# EAGLE schematic Tiny_UniProg (EAGLE 9.5.1)
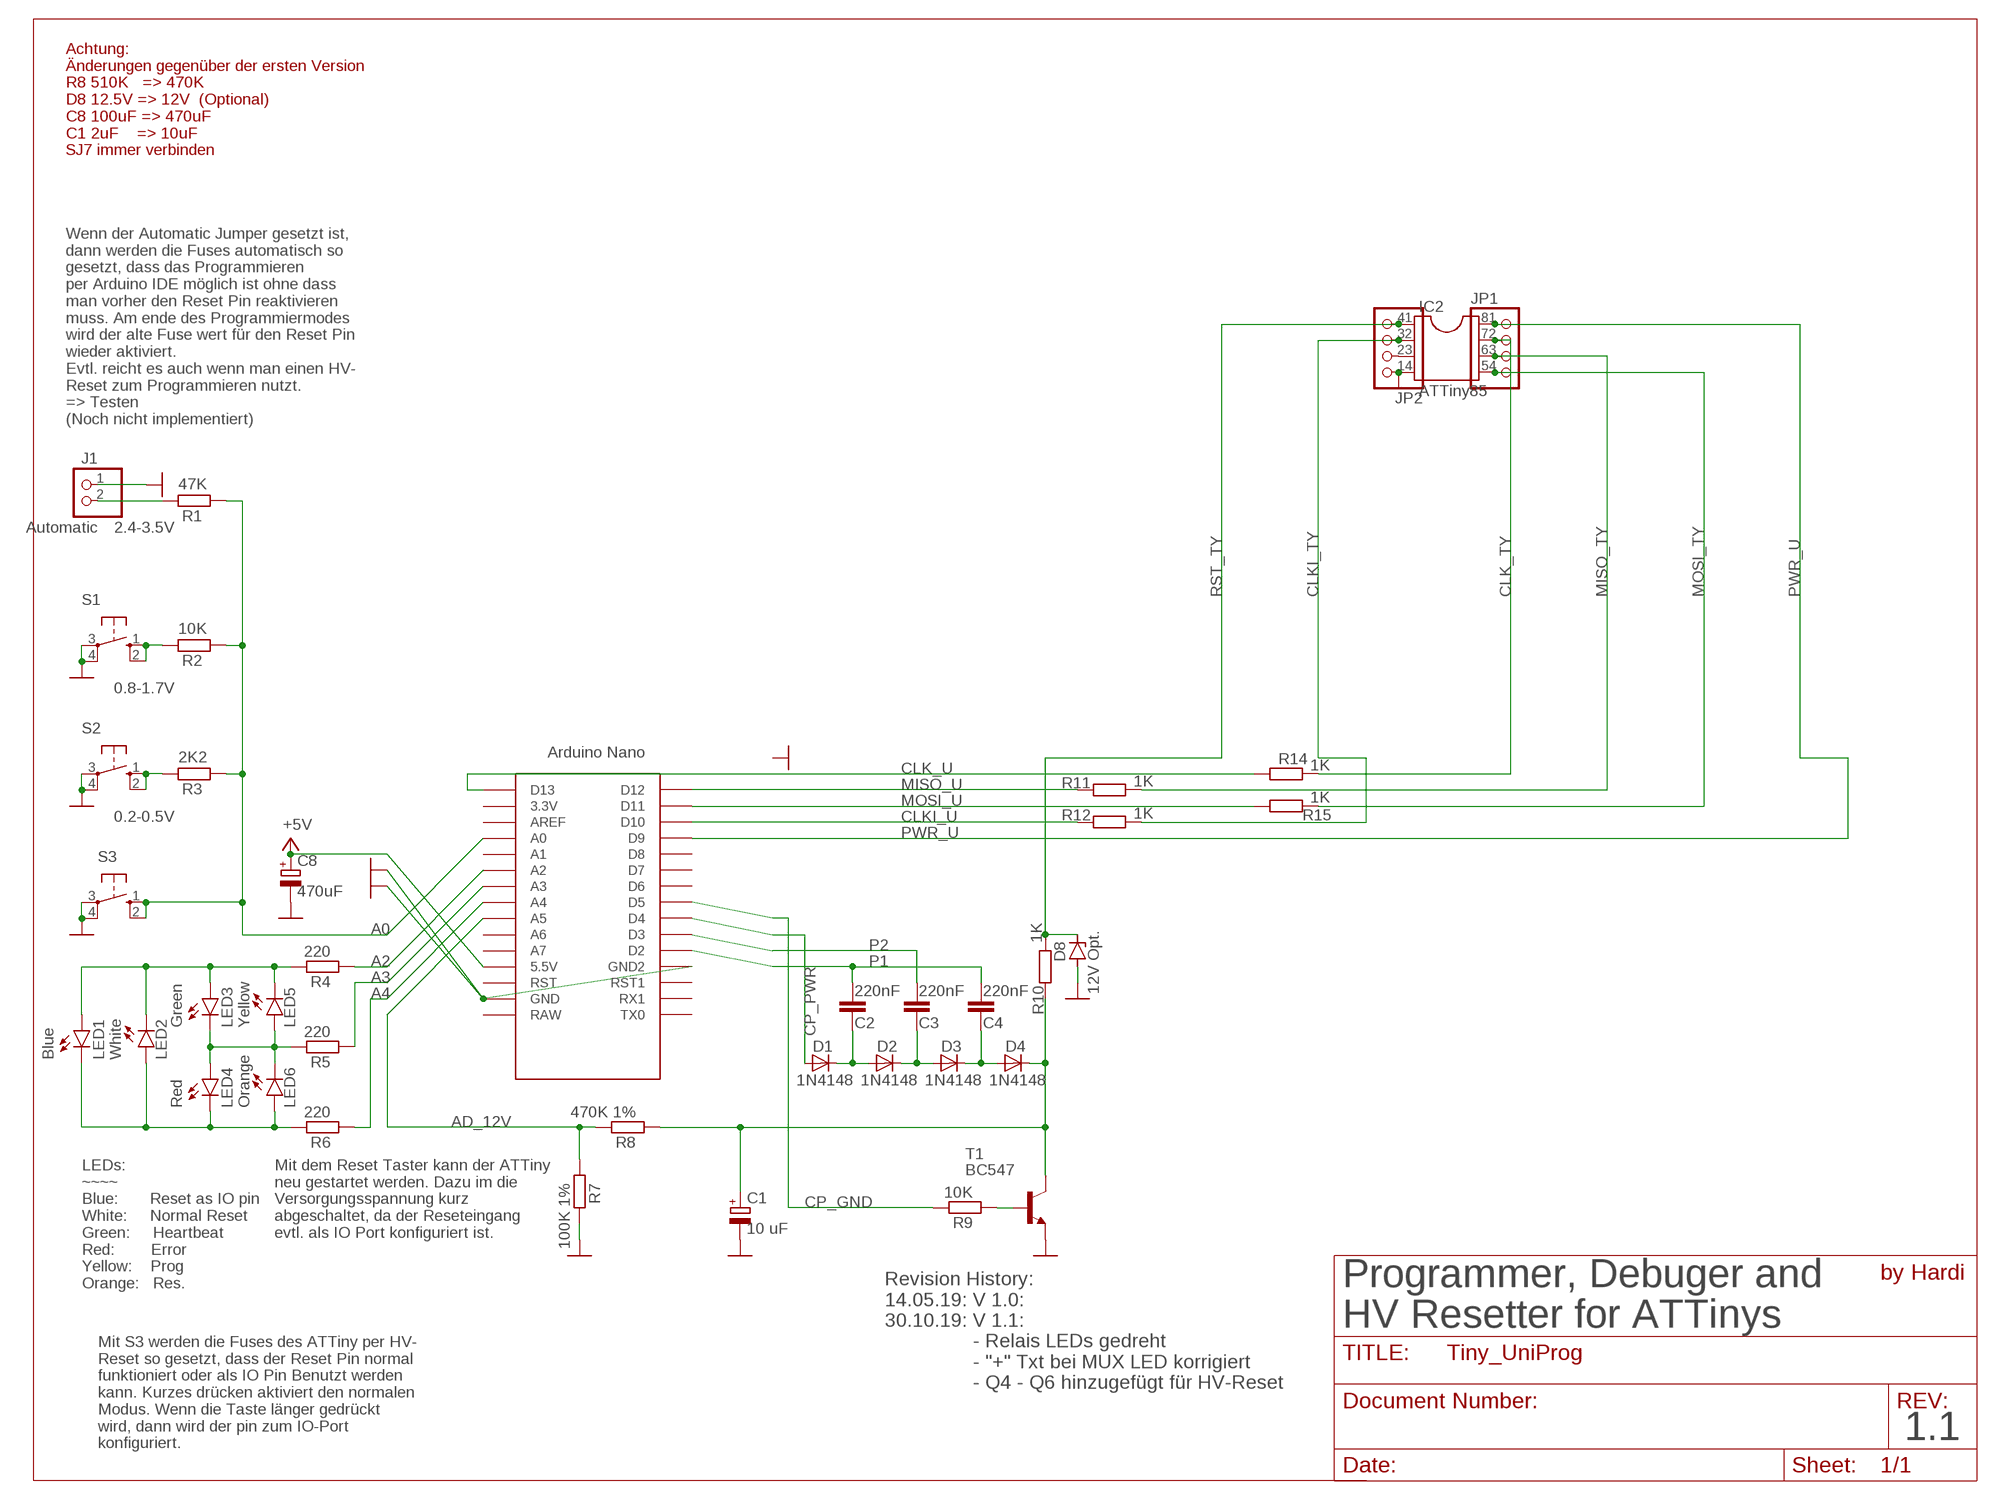
[diagram p0: schematic, sheet 1]

## Parts
C1  10 uF  CPOL-EUE5-5  [E5-5]
C2  220nF  C-EU050-024X044  [C050-024X044]
C3  220nF  C-EU050-024X044  [C050-024X044]
C4  220nF  C-EU050-024X044  [C050-024X044]
C8  470uF  CPOL-EUE5-10.5  [E5-10,5]
D1  1N4148  1N4148DO35-2  [DO35-2]
D2  1N4148  1N4148DO35-2  [DO35-2]
D3  1N4148  1N4148DO35-2  [DO35-2]
D4  1N4148  1N4148DO35-2  [DO35-2]
D8  12V Opt.  ZENER-DIODEZD-2.5  [ZDIO-2.5]
IC2  ATTiny85  DIL8  [DIL08]
J1  Automatic  PINHD-1X2  [1X02]
JP1  PINHD-1X4  [1X04]
JP2  PINHD-1X4  [1X04]
LED1  Blue  LED3MM  [LED3MM]
LED2  White  LED3MM  [LED3MM]
LED3  Green  LED3MM  [LED3MM]
LED4  Red  LED3MM  [LED3MM]
LED5  Yellow  LED3MM  [LED3MM]
LED6  Orange  LED3MM  [LED3MM]
R1  47K  R-EU_0204/2V  [0204V]
R2  10K  R-EU_0204/2V  [0204V]
R3  2K2  R-EU_0204/2V  [0204V]
R4  220  R-EU_0204/5  [0204/5]
R5  220  R-EU_0204/2V  [0204V]
R6  220  R-EU_0204/5  [0204/5]
R7  100K 1%  R-EU_0204/7  [0204/7]
R8  470K 1%  R-EU_0204/2V  [0204V]
R9  10K  R-EU_0207/12  [0207/12]
R10  1K  R-EU_0204/2V  [0204V]
R11  1K  R-EU_0204/2V  [0204V]
R12  1K  R-EU_0204/5  [0204/5]
R14  1K  R-EU_0207/12  [0207/12]
R15  1K  R-EU_0204/5  [0204/5]
S1  10-XX  [B3F-10XX]
S2  10-XX  [B3F-10XX]
S3  10-XX  [B3F-10XX]
T1  BC547  [TO92]
U$1  NANO  [NANO]

## Nets
+5V: C8.+ U$1.5V(5.5V)
A0: R1.1 R2.1 R3.1 S3.1(S) S3.2(S1) U$1.A0
A2: R4.1 U$1.A2
A3: R5.1 U$1.A3
A4: R6.1 U$1.A4
AD_12V: R7.1 R8.2 U$1.A5
CLK_TY: IC2.7 JP1.2 R14.2
CLK_U: R14.1 U$1.D13
CLKI_TY: IC2.2 JP2.3 R12.2
CLKI_U: R12.1 U$1.D10
CP_GND: R9.2 U$1.D5
CP_PWR: D1.A U$1.D4
GND: C1.- C8.- D8.A IC2.4 J1.1 JP2.1 R7.2 S1.3(P) S1.4(P1) S2.3(P) S2.4(P1) S3.3(P) S3.4(P1) T1.1(E) U$1.GND U$1.GND1(GND2)
MISO_TY: IC2.6 JP1.3 R11.2
MISO_U: R11.1 U$1.D12
MOSI_TY: IC2.5 JP1.4 R15.2
MOSI_U: R15.1 U$1.D11
N$1: C2.2 D1.C D2.A
N$2: C3.2 D2.C D3.A
N$3: C4.2 D3.C D4.A
N$4: IC2.3 JP2.2
N$7: R9.1 T1.2(B)
N$9: C1.+ D4.C R8.1 R10.2 T1.3(C)
N$28: J1.2 R1.2
N$33: R3.2 S2.1(S) S2.2(S1)
N$34: LED1.A LED2.K(C) LED3.A LED5.K(C) R4.2
N$42: LED3.K(C) LED4.A LED5.A LED6.K(C) R5.2
N$44: LED1.K(C) LED2.A LED4.K(C) LED6.A R6.2
N$67: R2.2 S1.1(S) S1.2(S1)
P1: C2.1 C4.1 U$1.D2
P2: C3.1 U$1.D3
PWR_U: IC2.8 JP1.1 U$1.D9
RST_TY: D8.C IC2.1 JP2.4 R10.1
Unconnected: U$1.3.3V U$1.A1 U$1.A6 U$1.A7 U$1.AREF U$1.D6 U$1.D7 U$1.D8 U$1.ICSP1 U$1.ICSP2 U$1.ICSP3 U$1.ICSP4 U$1.ICSP5 U$1.ICSP6 U$1.RAW U$1.RST U$1.RST1 U$1.RX1 U$1.TX0

## Notes on the sheet
- Achtung:
  Änderungen gegenüber der ersten Version
  R8 510K   => 470K
  D8 12.5V => 12V  (Optional)
  C8 100uF => 470uF
  C1 2uF    => 10uF
  SJ7 immer verbinden
- Wenn der Automatic Jumper gesetzt ist,
  dann werden die Fuses automatisch so
  gesetzt, dass das Programmieren
  per Arduino IDE möglich ist ohne dass
  man vorher den Reset Pin reaktivieren
  muss. Am ende des Programmiermodes
  wird der alte Fuse wert für den Reset Pin
  wieder aktiviert.
  Evtl. reicht es auch wenn man einen HV-
  Reset zum Programmieren nutzt.
  => Testen
  (Noch nicht implementiert)
- 2.4-3.5V
- 0.8-1.7V
- 0.2-0.5V
- LEDs:
  ~~~~
  Blue:       Reset as IO pin
  White:     Normal Reset
  Green:     Heartbeat
  Red:        Error
  Yellow:    Prog
  Orange:   Res.
- Mit dem Reset Taster kann der ATTiny
  neu gestartet werden. Dazu im die
  Versorgungsspannung kurz
  abgeschaltet, da der Reseteingang
  evtl. als IO Port konfiguriert ist.
- Revision History:
  14.05.19: V 1.0: 
  30.10.19: V 1.1: 
                  - Relais LEDs gedreht 
                  - "+" Txt bei MUX LED korrigiert
                  - Q4 - Q6 hinzugefügt für HV-Reset
- by Hardi
- Programmer, Debuger and 
  HV Resetter for ATTinys
- Mit S3 werden die Fuses des ATTiny per HV-
  Reset so gesetzt, dass der Reset Pin normal
  funktioniert oder als IO Pin Benutzt werden
  kann. Kurzes drücken aktiviert den normalen
  Modus. Wenn die Taste länger gedrückt
  wird, dann wird der pin zum IO-Port 
  konfiguriert.
- 1.1

## Library data of the parts
C1 C8 = rcl:CPOL-EU: POLARIZED CAPACITOR, European symbol; SPICEPREFIX: C
C2-C4 = rcl:C-EU: CAPACITOR, European symbol; SPICEPREFIX: C
D1-D4 = diode:1N4148: DIODE high speed (Philips)
D8 = diode:ZENER-DIODE: Z-Diode
IC2 = ic-package:DIL8: Dual In Line / Socket
J1 = pinhead:PINHD-1X2: PIN HEADER
JP1 JP2 = pinhead:PINHD-1X4: PIN HEADER
LED1-LED6 = led:LED: LED OSRAM: - CHIPLED LG R971, LG N971, LY N971, LG Q971, LY Q971, LO R971, LY R971 LH N974, LH R974 LS Q976, LO Q976, LY Q976 LO Q996 - Hyper CHIPLED LW Q18S LB Q993, LB Q99A, LB R99A - SideLED LS A670, LO A670, LY A670, LG A670, LP A670 LB A673, LV A673, LT A673, LW A673 LH A674 LY A675 LS A676, LA A676, LO A676, LY A676, LW A676 LS A679, LY A679, LG A679 - Hyper Micro SIDELED® LS Y876, LA Y876, LO Y876, LY Y876 LT Y87S - SmartLED LW L88C, LW L88S LB L89C, LB L89S, LG L890 LS L89K, LO L89K, LY L89K LS L896, LA L896, LO L896, LY L896 - TOPLED LS T670, LO T670, LY T670, LG T670, LP T670 LSG T670, LSP T670, LSY T670, LOP T670, LYG T670 LG T671, LOG T671, LSG T671 LB T673, LV T673, LT T673, LW T673 LH T674 LS T676, LA T676, LO T676, LY T676, LB T676, LH T676, LSB T676, LW T676 LB T67C, LV T67C, LT T67C, LS T67K, LO T67K, LY T67K, LW E67C LS E67B, LA E67B, LO E67B, LY E67B, LB E67C, LV E67C, LT E67C LW T67C LS T679, LY T679, LG T679 LS T770, LO T770, LY T770, LG T770, LP T770 LB T773, LV T773, LT T773, LW T773 LH T774 LS E675, LA E675, LY E675, LS T675 LS T776, LA T776, LO T776, LY T776, LB T776 LHGB T686 LT T68C, LB T68C - Hyper Mini TOPLED® LB M676 - Mini TOPLED Santana® LG M470 LS M47K, LO M47K, LY M47K Source: http://www.osram.convergy.de LUXEON: - LUMILED® LXK2-PW12-R00, LXK2-PW12-S00, LXK2-PW14-U00, LXK2-PW14-V00 LXK2-PM12-R00, LXK2-PM12-S00, LXK2-PM14-U00 LXK2-PE12-Q00, LXK2-PE12-R00, LXK2-PE12-S00, LXK2-PE14-T00, LXK2-PE14-U00 LXK2-PB12-K00, LXK2-PB12-L00, LXK2-PB12-M00, LXK2-PB14-N00, LXK2-PB14-P00, LXK2-PB14-Q00 LXK2-PR12-L00, LXK2-PR12-M00, LXK2-PR14-Q00, LXK2-PR14-R00 LXK2-PD12-Q00, LXK2-PD12-R00, LXK2-PD12-S00 LXK2-PH12-R00, LXK2-PH12-S00 LXK2-PL12-P00, LXK2-PL12-Q00, LXK2-PL12-R00 Source: www.luxeon.com KINGBRIGHT: KA-3528ASYC Source: www.kingbright.com
R1-R12 R14 R15 = rcl:R-EU_: RESISTOR, European symbol; SPICEPREFIX: R
S1-S3 = switch-omron:10-XX: OMRON SWITCH; MPN: B3F-1000; OC_FARNELL: 176432; OC_NEWARK: 36M3542
T1 = transistor:BC547: NPN TRANSISTOR
U$1 = Arduino-clone:NANO: Arduino Nano